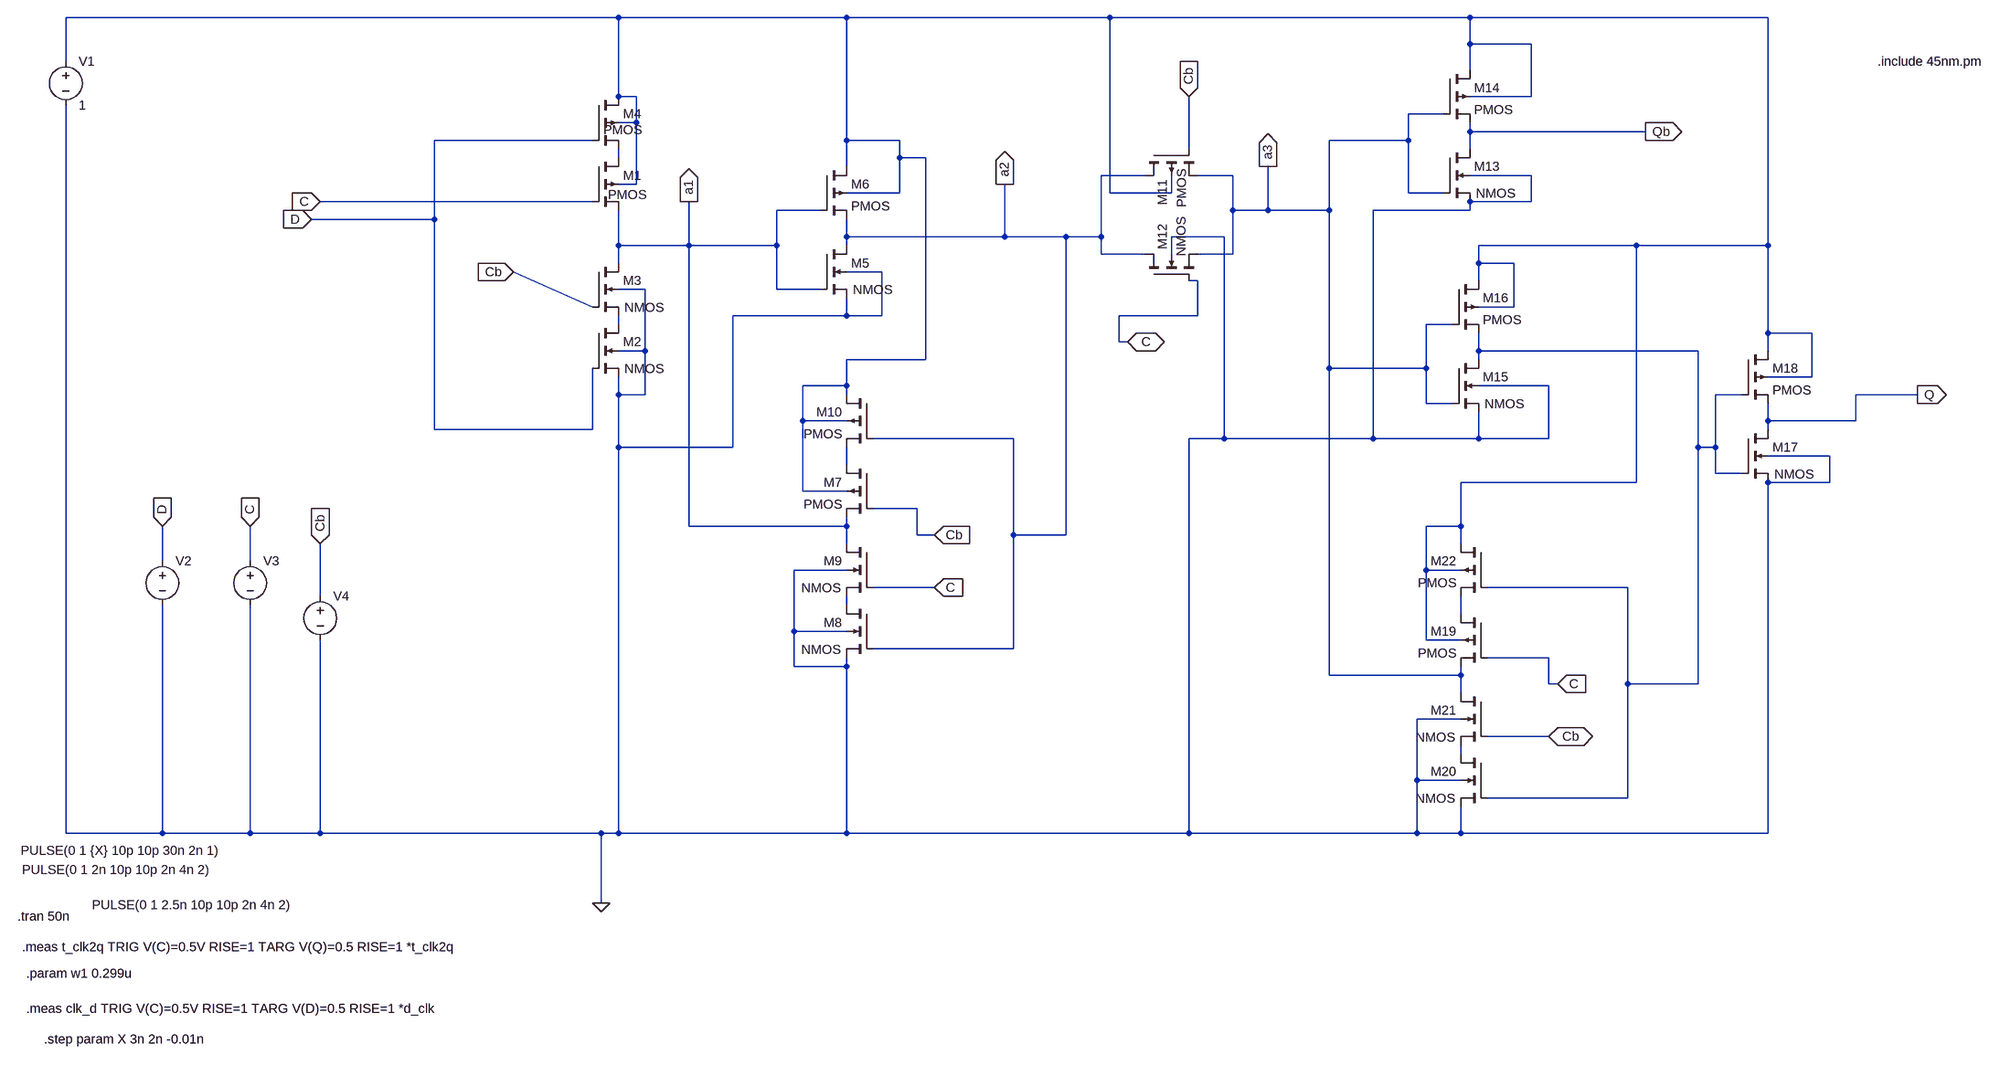
[diagram p0: schematic new1-hold.asc]
new1-hold.asc, the LTspice schematic file:
Version 4
SHEET 1 2712 1544
WIRE 208 -336 -800 -336
WIRE 624 -336 208 -336
WIRE 1104 -336 624 -336
WIRE 1760 -336 1104 -336
WIRE 2304 -336 1760 -336
WIRE 1760 -288 1760 -336
WIRE 1872 -288 1760 -288
WIRE -800 -256 -800 -336
WIRE 1760 -240 1760 -288
WIRE 208 -192 208 -336
WIRE 240 -192 208 -192
WIRE 1872 -192 1872 -288
WIRE 1872 -192 1760 -192
WIRE 1712 -160 1648 -160
WIRE 240 -144 240 -192
WIRE 240 -144 208 -144
WIRE 1760 -128 1760 -144
WIRE 2080 -128 1760 -128
WIRE 160 -112 -128 -112
WIRE 624 -112 624 -336
WIRE 720 -112 624 -112
WIRE 1648 -112 1648 -160
WIRE 1648 -112 1504 -112
WIRE 1248 -96 1248 -192
WIRE 1760 -96 1760 -128
WIRE 208 -80 208 -96
WIRE 720 -80 720 -112
WIRE 768 -80 720 -80
WIRE 624 -64 624 -112
WIRE 1168 -48 1088 -48
WIRE 1328 -48 1264 -48
WIRE 1872 -48 1760 -48
WIRE 240 -32 240 -144
WIRE 240 -32 208 -32
WIRE 720 -16 720 -80
WIRE 720 -16 624 -16
WIRE 1104 -16 1104 -336
WIRE 1216 -16 1216 -48
WIRE 1216 -16 1104 -16
WIRE 1648 -16 1648 -112
WIRE 1712 -16 1648 -16
WIRE 160 0 -336 0
WIRE 1872 0 1872 -48
WIRE 1872 0 1760 0
WIRE 576 16 496 16
WIRE 1328 16 1328 -48
WIRE 1392 16 1392 -64
WIRE 1392 16 1328 16
WIRE 1504 16 1504 -112
WIRE 1504 16 1392 16
WIRE 1760 16 1760 0
WIRE 1760 16 1584 16
WIRE -128 32 -128 -112
WIRE -128 32 -352 32
WIRE 624 64 624 32
WIRE 912 64 912 -32
WIRE 912 64 624 64
WIRE 1024 64 912 64
WIRE 1088 64 1088 -48
WIRE 1088 64 1024 64
WIRE 1312 64 1216 64
WIRE 208 80 208 16
WIRE 336 80 336 0
WIRE 336 80 208 80
WIRE 496 80 496 16
WIRE 496 80 336 80
WIRE 624 80 624 64
WIRE 2064 80 1776 80
WIRE 2304 80 2304 -336
WIRE 2304 80 2064 80
WIRE 1088 96 1088 64
WIRE 1168 96 1088 96
WIRE 1216 96 1216 64
WIRE 1328 96 1328 16
WIRE 1328 96 1264 96
WIRE 208 112 208 80
WIRE 1776 112 1776 80
WIRE 1840 112 1776 112
WIRE 688 128 624 128
WIRE 1264 144 1248 144
WIRE 1776 144 1776 112
WIRE 256 160 208 160
WIRE 496 160 496 80
WIRE 576 160 496 160
WIRE 160 192 16 128
WIRE 1840 192 1840 112
WIRE 1840 192 1776 192
WIRE 624 208 624 176
WIRE 624 208 416 208
WIRE 688 208 688 128
WIRE 688 208 624 208
WIRE 1264 208 1264 144
WIRE 1264 208 1120 208
WIRE 208 224 208 208
WIRE 1728 224 1680 224
WIRE 2304 240 2304 80
WIRE 2384 240 2304 240
WIRE 1120 256 1120 208
WIRE 1136 256 1120 256
WIRE 256 272 256 160
WIRE 256 272 208 272
WIRE 1776 272 1776 240
WIRE 2176 272 1776 272
WIRE 2304 272 2304 240
WIRE 768 288 768 -80
WIRE 768 288 624 288
WIRE 1776 288 1776 272
WIRE 1504 304 1504 16
WIRE 1680 304 1680 224
WIRE 1680 304 1504 304
WIRE 2384 320 2384 240
WIRE 2384 320 2304 320
WIRE 624 336 624 288
WIRE 624 336 544 336
WIRE 1904 336 1776 336
WIRE 208 352 208 320
WIRE 256 352 256 272
WIRE 256 352 208 352
WIRE 624 352 624 336
WIRE 2256 352 2208 352
WIRE 2576 352 2464 352
WIRE 1680 368 1680 304
WIRE 1728 368 1680 368
WIRE 544 400 544 336
WIRE 624 400 544 400
WIRE 2304 400 2304 368
WIRE 2464 400 2464 352
WIRE 2464 400 2304 400
WIRE -128 416 -128 32
WIRE 160 416 160 304
WIRE 160 416 -128 416
WIRE 2304 416 2304 400
WIRE 928 432 672 432
WIRE 1312 432 1312 64
WIRE 1312 432 1248 432
WIRE 1584 432 1584 16
WIRE 1584 432 1312 432
WIRE 1776 432 1776 384
WIRE 1776 432 1584 432
WIRE 1904 432 1904 336
WIRE 1904 432 1776 432
WIRE 208 448 208 352
WIRE 416 448 416 208
WIRE 416 448 208 448
WIRE 2176 448 2176 272
WIRE 2208 448 2208 352
WIRE 2208 448 2176 448
WIRE 2416 464 2304 464
WIRE 624 480 624 448
WIRE 2208 496 2208 448
WIRE 2256 496 2208 496
WIRE 2064 512 2064 80
WIRE 2064 512 1744 512
WIRE 2416 512 2416 464
WIRE 2416 512 2304 512
WIRE 544 528 544 400
WIRE 624 528 544 528
WIRE 752 560 672 560
WIRE 336 592 336 80
WIRE 624 592 624 576
WIRE 624 592 336 592
WIRE 1744 592 1744 512
WIRE 1744 592 1680 592
WIRE 752 608 752 560
WIRE 784 608 752 608
WIRE 928 608 928 432
WIRE 1024 608 1024 64
WIRE 1024 608 928 608
WIRE 624 624 624 592
WIRE 1744 624 1744 592
WIRE -624 656 -624 592
WIRE -464 656 -464 592
WIRE 624 672 528 672
WIRE 1680 672 1680 592
WIRE 1744 672 1680 672
WIRE 784 704 672 704
WIRE 2048 704 1792 704
WIRE -336 720 -336 624
WIRE 624 736 624 720
WIRE 1744 752 1744 720
WIRE 528 784 528 672
WIRE 624 784 528 784
WIRE 1680 800 1680 672
WIRE 1744 800 1680 800
WIRE 928 816 928 608
WIRE 928 816 672 816
WIRE 1904 832 1792 832
WIRE 528 848 528 784
WIRE 624 848 624 832
WIRE 624 848 528 848
WIRE 1504 864 1504 304
WIRE 1744 864 1744 848
WIRE 1744 864 1504 864
WIRE 1904 880 1904 832
WIRE 1920 880 1904 880
WIRE 2048 880 2048 704
WIRE 2176 880 2176 448
WIRE 2176 880 2048 880
WIRE 1744 896 1744 864
WIRE 1744 944 1664 944
WIRE 1904 976 1792 976
WIRE 1744 1008 1744 992
WIRE 1664 1056 1664 944
WIRE 1744 1056 1664 1056
WIRE 2048 1088 2048 880
WIRE 2048 1088 1792 1088
WIRE -800 1152 -800 -176
WIRE -624 1152 -624 736
WIRE -624 1152 -800 1152
WIRE -464 1152 -464 736
WIRE -464 1152 -624 1152
WIRE -336 1152 -336 800
WIRE -336 1152 -464 1152
WIRE 176 1152 -336 1152
WIRE 208 1152 208 448
WIRE 208 1152 176 1152
WIRE 624 1152 624 848
WIRE 624 1152 208 1152
WIRE 1248 1152 1248 432
WIRE 1248 1152 624 1152
WIRE 1664 1152 1664 1056
WIRE 1664 1152 1248 1152
WIRE 1744 1152 1744 1104
WIRE 1744 1152 1664 1152
WIRE 2304 1152 2304 512
WIRE 2304 1152 1744 1152
WIRE 176 1280 176 1152
FLAG 176 1280 0
FLAG -352 32 D
IOPIN -352 32 In
FLAG -336 0 C
IOPIN -336 0 In
FLAG 784 704 C
IOPIN 784 704 In
FLAG 1904 976 Cb
IOPIN 1904 976 BiDir
FLAG 1248 -192 Cb
IOPIN 1248 -192 In
FLAG 2576 352 Q
IOPIN 2576 352 Out
FLAG 2080 -128 Qb
IOPIN 2080 -128 Out
FLAG -624 592 D
IOPIN -624 592 In
FLAG -464 592 C
IOPIN -464 592 In
FLAG 336 0 a1
IOPIN 336 0 Out
FLAG 912 -32 a2
IOPIN 912 -32 Out
FLAG 1392 -64 a3
IOPIN 1392 -64 Out
FLAG 16 128 Cb
IOPIN 16 128 In
FLAG 1136 256 C
IOPIN 1136 256 BiDir
FLAG 784 608 Cb
IOPIN 784 608 In
FLAG 1920 880 C
IOPIN 1920 880 In
FLAG -336 624 Cb
IOPIN -336 624 In
SYMBOL pmos4 160 -80 R0
WINDOW 3 29 67 Left 2
SYMATTR InstName M1
SYMATTR Value2 l=45n w=w1
SYMBOL nmos4 160 224 R0
WINDOW 3 59 81 Left 2
SYMATTR InstName M2
SYMATTR Value2 l=45n w=0.2u
SYMBOL nmos4 160 112 R0
WINDOW 3 59 81 Left 2
SYMATTR InstName M3
SYMATTR Value2 l=45n w=0.2u
SYMBOL pmos4 160 -192 R0
WINDOW 3 20 61 Left 2
SYMATTR InstName M4
SYMATTR Value2 l=45n w=w1
SYMBOL nmos4 576 80 R0
WINDOW 3 59 81 Left 2
SYMATTR InstName M5
SYMATTR Value2 l=45n w=0.2u
SYMBOL pmos4 576 -64 R0
SYMATTR InstName M6
SYMATTR Value2 l=45n w=0.4u
SYMBOL pmos4 672 480 M0
SYMATTR InstName M7
SYMATTR Value2 l=45n w=w1
SYMBOL nmos4 672 736 M0
WINDOW 3 59 81 Left 2
SYMATTR InstName M8
SYMATTR Value2 l=45n w=0.2u
SYMBOL nmos4 672 624 M0
WINDOW 3 59 81 Left 2
SYMATTR InstName M9
SYMATTR Value2 l=45n w=0.2u
SYMBOL pmos4 672 352 M0
SYMATTR InstName M10
SYMATTR Value2 l=45n w=w1
SYMBOL pmos4 1168 -96 M90
WINDOW 3 37 67 Left 2
SYMATTR InstName M11
SYMATTR Value2 l=45n w=0.4u
SYMBOL nmos4 1168 144 R270
WINDOW 3 44 66 Left 2
SYMATTR InstName M12
SYMATTR Value2 l=45n w=0.2u
SYMBOL nmos4 1712 -96 R0
WINDOW 3 59 81 Left 2
SYMATTR InstName M13
SYMATTR Value2 l=45n w=0.2u
SYMBOL pmos4 1712 -240 R0
SYMATTR InstName M14
SYMATTR Value2 l=45n w=0.4u
SYMBOL nmos4 1728 288 R0
WINDOW 3 59 81 Left 2
SYMATTR InstName M15
SYMATTR Value2 l=45n w=0.2u
SYMBOL pmos4 1728 144 R0
SYMATTR InstName M16
SYMATTR Value2 l=45n w=0.296u
SYMBOL nmos4 2256 416 R0
WINDOW 3 59 81 Left 2
SYMATTR InstName M17
SYMATTR Value2 l=45n w=0.2u
SYMBOL pmos4 2256 272 R0
SYMATTR InstName M18
SYMATTR Value2 l=45n w=0.4u
SYMBOL pmos4 1792 752 M0
SYMATTR InstName M19
SYMATTR Value2 l=45n w=w1
SYMBOL nmos4 1792 1008 M0
WINDOW 3 59 81 Left 2
SYMATTR InstName M20
SYMATTR Value2 l=45n w=0.2u
SYMBOL nmos4 1792 896 M0
WINDOW 3 59 81 Left 2
SYMATTR InstName M21
SYMATTR Value2 l=45n w=0.2u
SYMBOL pmos4 1792 624 M0
SYMATTR InstName M22
SYMATTR Value2 l=45n w=w1
SYMBOL voltage -800 -272 R0
WINDOW 123 0 0 Left 0
WINDOW 39 0 0 Left 0
SYMATTR InstName V1
SYMATTR Value 1
SYMBOL voltage -624 640 R0
WINDOW 3 -258 544 Left 2
WINDOW 123 0 0 Left 0
WINDOW 39 0 0 Left 0
SYMATTR Value PULSE(0 1 {X} 10p 10p 30n 2n 1)
SYMATTR InstName V2
SYMBOL voltage -464 640 R0
WINDOW 3 -416 579 Left 2
WINDOW 123 0 0 Left 0
WINDOW 39 0 0 Left 0
SYMATTR Value PULSE(0 1 2n 10p 10p 2n 4n 2)
SYMATTR InstName V3
SYMBOL voltage -336 704 R0
WINDOW 3 -416 579 Left 2
WINDOW 123 0 0 Left 0
WINDOW 39 0 0 Left 0
SYMATTR Value PULSE(0 1 2.5n 10p 10p 2n 4n 2)
SYMATTR InstName V4
TEXT 2504 -256 Left 2 !.include 45nm.pm
TEXT -888 1304 Left 2 !.tran 50n
TEXT -880 1360 Left 2 !.meas t_clk2q TRIG V(C)=0.5V RISE=1 TARG V(Q)=0.5 RISE=1 *t_clk2q
TEXT -872 1408 Left 2 !.param w1 0.299u
TEXT -872 1472 Left 2 !.meas clk_d TRIG V(C)=0.5V RISE=1 TARG V(D)=0.5 RISE=1 *d_clk
TEXT -840 1528 Left 2 !.step param X 3n 2n -0.01n

The netlist it stands for:
* new1-hold.asc
M1 N002 C a1 N001 PMOS l=45n w=w1
M2 N003 D 0 0 NMOS l=45n w=0.2u
M3 a1 Cb N003 0 NMOS l=45n w=0.2u
M4 N001 D N002 N001 PMOS l=45n w=w1
M5 a2 a1 0 0 NMOS l=45n w=0.2u
M6 N001 a1 a2 N001 PMOS l=45n w=0.4u
M7 N005 Cb a1 N001 PMOS l=45n w=w1
M8 N006 a2 0 0 NMOS l=45n w=0.2u
M9 a1 C N006 0 NMOS l=45n w=0.2u
M10 N001 a2 N005 N001 PMOS l=45n w=w1
M11 a2 Cb a3 N001 PMOS l=45n w=0.4u
M12 a2 C a3 0 NMOS l=45n w=0.2u
M13 Qb a3 0 0 NMOS l=45n w=0.2u
M14 N001 a3 Qb N001 PMOS l=45n w=0.4u
M15 N004 a3 0 0 NMOS l=45n w=0.2u
M16 N001 a3 N004 N001 PMOS l=45n w=0.296u
M17 Q N004 0 0 NMOS l=45n w=0.2u
M18 N001 N004 Q N001 PMOS l=45n w=0.4u
M19 N007 C a3 N001 PMOS l=45n w=w1
M20 N008 N004 0 0 NMOS l=45n w=0.2u
M21 a3 Cb N008 0 NMOS l=45n w=0.2u
M22 N001 N004 N007 N001 PMOS l=45n w=w1
V1 N001 0 1
V2 D 0 PULSE(0 1 {X} 10p 10p 30n 2n 1)
V3 C 0 PULSE(0 1 2n 10p 10p 2n 4n 2)
V4 Cb 0 PULSE(0 1 2.5n 10p 10p 2n 4n 2)
.model NMOS NMOS
.model PMOS PMOS
.lib standard.mos
.include 45nm.pm
.tran 50n
.meas t_clk2q TRIG V(C)=0.5V RISE=1 TARG V(Q)=0.5 RISE=1 *t_clk2q
.param w1 0.299u
.meas clk_d TRIG V(C)=0.5V RISE=1 TARG V(D)=0.5 RISE=1 *d_clk
.step param X 3n 2n -0.01n
.backanno
.end